# Altium schematic sheet Digital Isolator.SchDoc
size A3; Date: 27.05.2014; DrawnBy: luths8; Organization: BFH; Address1: Bern University of Applied Sciences; Address2: Engineering and Information Technology; Address3: Jlcoweg 1; Address4: CH-3400 Burgdorf; DocumentNumber: 17; Revision: 1.0; SheetNumber: 4; SheetTotal: 19; CurrentDate: 27.05.2014
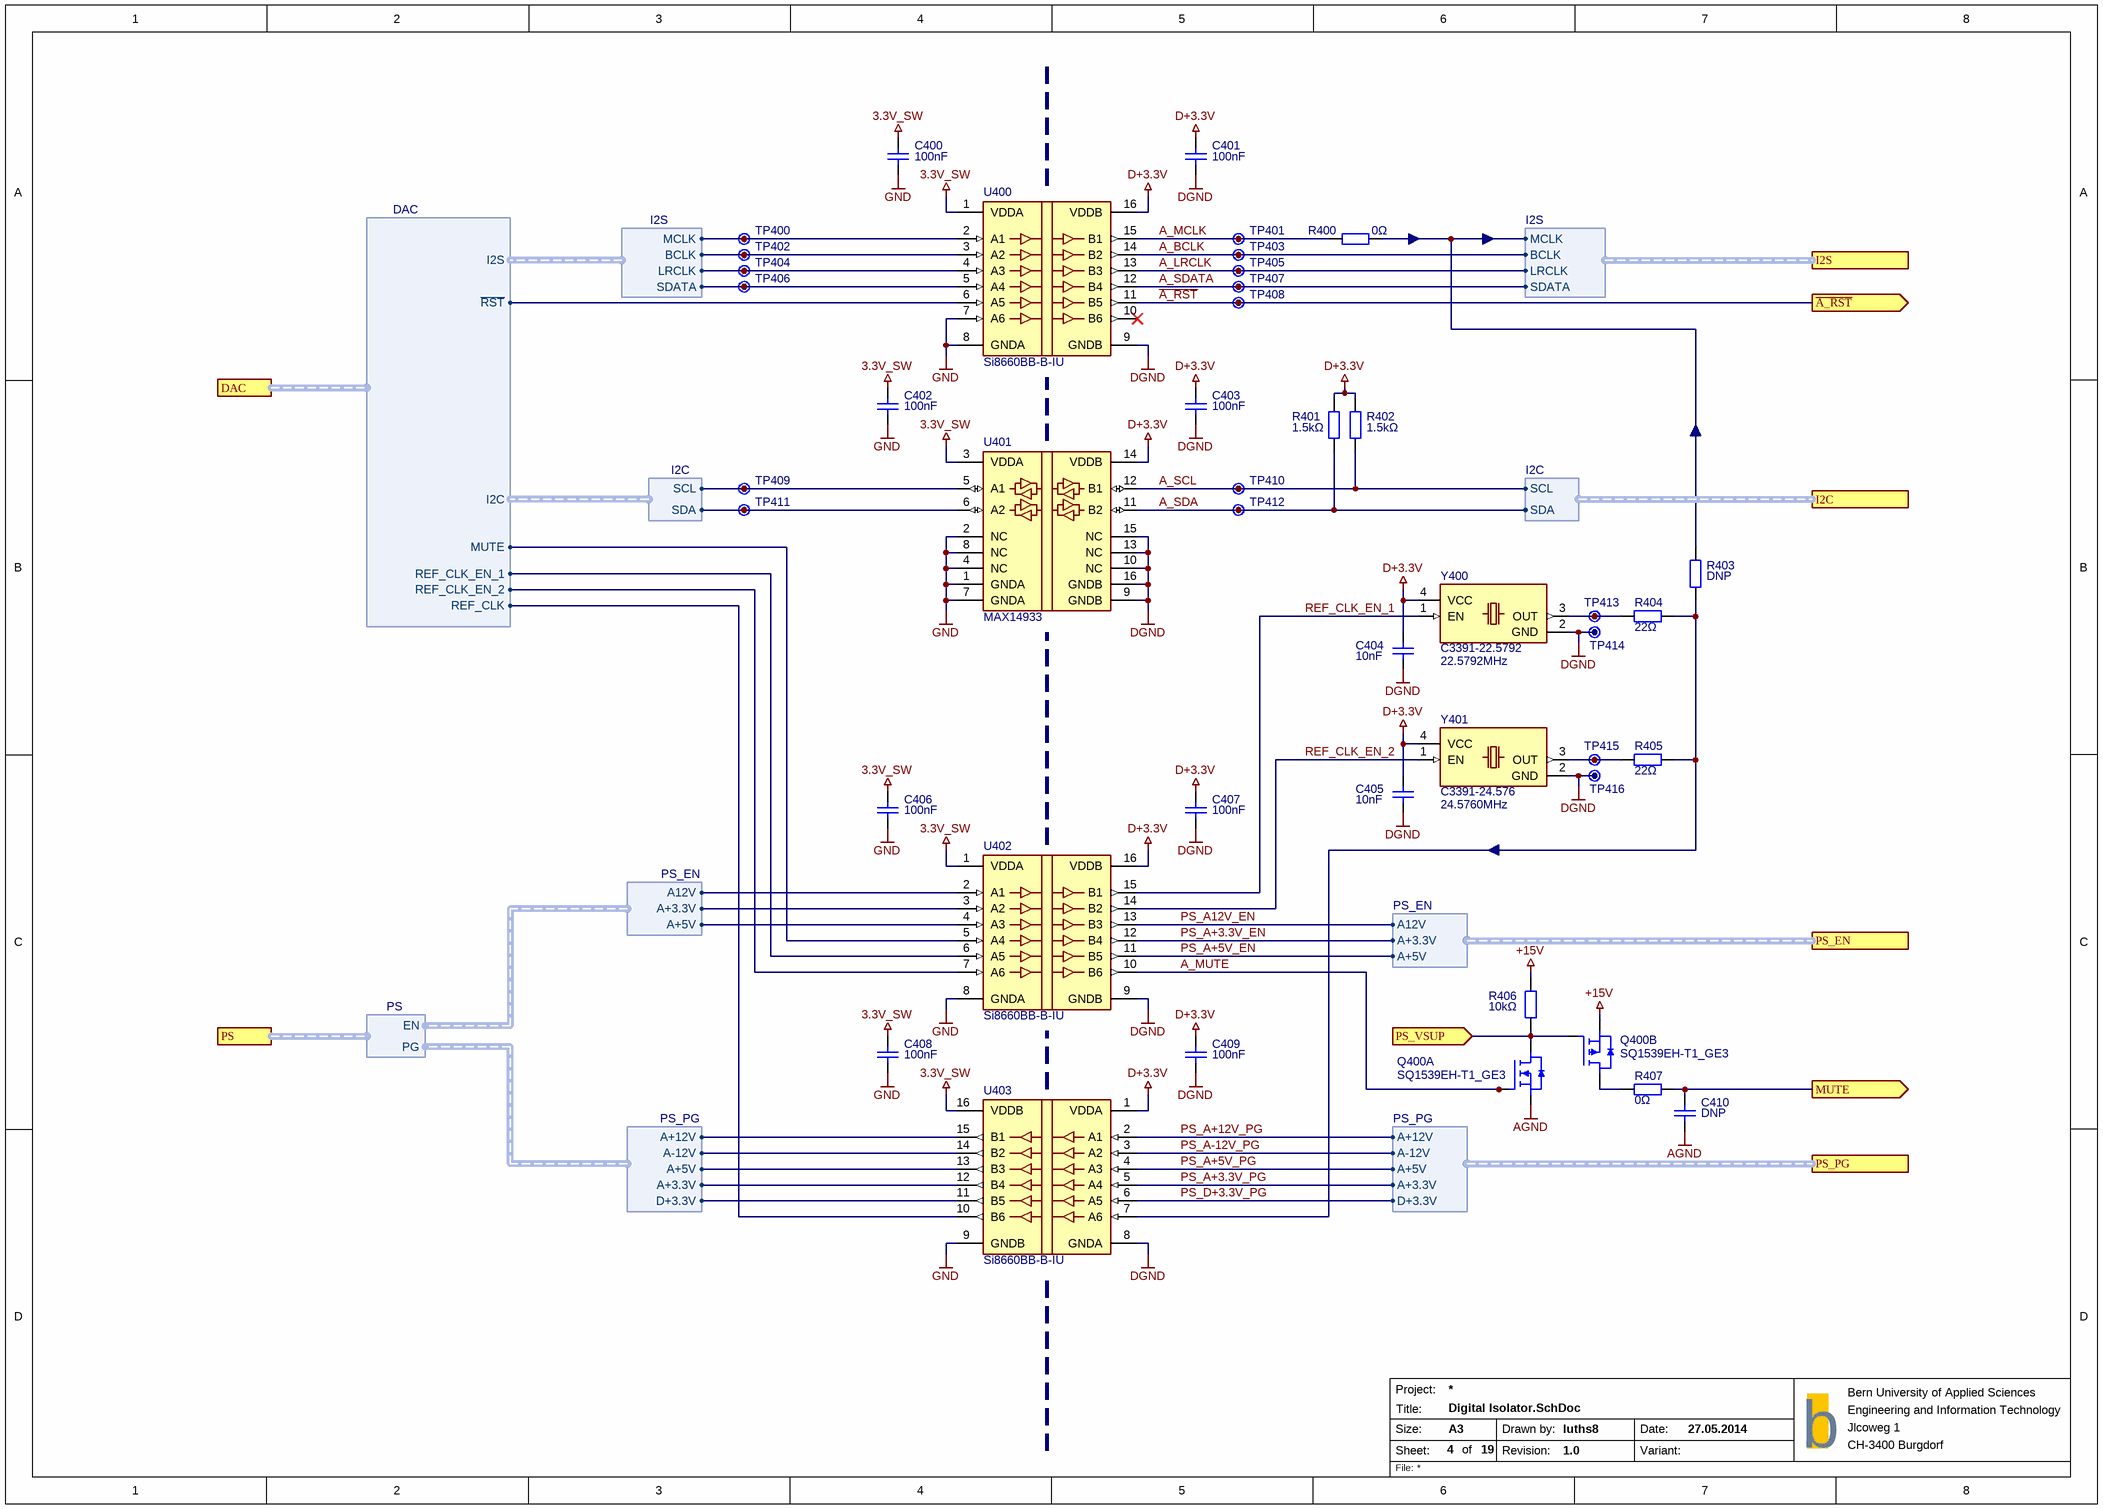
[diagram p0: Digital Isolator.SchDoc]

## Parts
C400  100nF  [SMD0603CAP]
C401  100nF  [SMD0603CAP]
C402  100nF  [SMD0603CAP]
C403  100nF  [SMD0603CAP]
C404  10nF  [SMD0603CAP]
C405  10nF  [SMD0603CAP]
C406  100nF  [SMD0603CAP]
C407  100nF  [SMD0603CAP]
C408  100nF  [SMD0603CAP]
C409  100nF  [SMD0603CAP]
C410  DNP  [SMD0603CAP]
Q400  SQ1539EH-T1_GE3  [SOT-363-6]  (parts A,B of 2)
R400  0Ω  [SMD0603RES]
R401  1.5kΩ  [SMD0603RES]
R402  1.5kΩ  [SMD0603RES]
R403  DNP  [SMD0603RES]
R404  22Ω  [SMD0603RES]
R405  22Ω  [SMD0603RES]
R406  10kΩ  [SMD0603RES]
R407  0Ω  [SMD0603RES]
TP400  Testpoint  [TP]  (value not drawn)  (no BOM)
TP401  Testpoint  [TP]  (value not drawn)  (no BOM)
TP402  Testpoint  [TP]  (value not drawn)  (no BOM)
TP403  Testpoint  [TP]  (value not drawn)  (no BOM)
TP404  Testpoint  [TP]  (value not drawn)  (no BOM)
TP405  Testpoint  [TP]  (value not drawn)  (no BOM)
TP406  Testpoint  [TP]  (value not drawn)  (no BOM)
TP407  Testpoint  [TP]  (value not drawn)  (no BOM)
TP408  Testpoint  [TP]  (value not drawn)  (no BOM)
TP409  Testpoint  [TP]  (value not drawn)  (no BOM)
TP410  Testpoint  [TP]  (value not drawn)  (no BOM)
TP411  Testpoint  [TP]  (value not drawn)  (no BOM)
TP412  Testpoint  [TP]  (value not drawn)  (no BOM)
TP413  Testpoint  [TP]  (value not drawn)  (no BOM)
TP414  Testpoint  [TP]  (value not drawn)  (no BOM)
TP415  Testpoint  [TP]  (value not drawn)  (no BOM)
TP416  Testpoint  [TP]  (value not drawn)  (no BOM)
U400  Si8660BB-B-IU  [SOIC16WIDE]
U401  MAX14933  [SOIC16WIDE]
U402  Si8660BB-B-IU  [SOIC16WIDE]
U403  Si8660BB-B-IU  [SOIC16WIDE]
Y400  C3391-22.5792  Frequency: 22.5792MHz  [OSC_CRYSTEK]
Y401  C3391-24.576  Frequency: 24.5760MHz  [OSC_CRYSTEK]

## Ports
DAC (harness DAC), I2C (harness I2C), I2S (harness I2S), MUTE (out), PS (harness PS), PS_EN (harness PS_EN), PS_PG (harness PS_PG), PS_VSUP (in), ~{A_RST} (out)

## Harnesses
I2S: MCLK, BCLK, LRCLK, SDATA
I2C: SCL, SDA
DAC: I2S, ~{RST}, I2C, MUTE, REF_CLK_EN_1, REF_CLK_EN_2, REF_CLK
PS_EN: A12V, A+3.3V, A+5V
PS_PG: A+12V, A-12V, A+3.3V, A+5V, D+3.3V
PS: EN, PG

## Nets
3.3V_SW: C400.1 C402.1 C406.1 C408.1 U400.1(VDDA) U401.3(VDDA) U402.1(VDDA) U403.16(VDDB)
+15V: Q400.4(S) R406.2
AGND: C410.2(q) Q400.1(S)
D+3.3V: C401.1 C403.1 C404.1 C405.1 C407.1 C409.1 R401.2 R402.2 U400.16(VDDB) U401.14(VDDB) U402.16(VDDB) U403.1(VDDA) Y400.4(VCC) Y401.4(VCC)
DGND: C401.2(q) C403.2(q) C404.2(q) C405.2(q) C407.2(q) C409.2(q) TP414.1 TP416.1 U400.9(GNDB) U401.9(GNDB) U401.10(NC) U401.13(NC) U401.15(NC) U401.16(GNDB) U402.9(GNDB) U403.8(GNDA) Y400.2(GND) Y401.2(GND)
GND: C400.2(q) C402.2(q) C406.2(q) C408.2(q) U400.7(A6) U400.8(GNDA) U401.1(GNDA) U401.2(NC) U401.4(NC) U401.7(GNDA) U401.8(NC) U402.8(GNDA) U403.9(GNDB)
~{A_RST}: TP408.1 U400.11(B5) ; port ~{A_RST}
A_BCLK: TP403.1 U400.14(B2) ; port I2S.BCLK
A_LRCLK: TP405.1 U400.13(B3) ; port I2S.LRCLK
A_MCLK: R400.2 TP401.1 U400.15(B1)
A_MUTE: Q400.2(G) U402.10(B6)
A_SCL: R402.1 TP410.1 U401.12(B1) ; port I2C.SCL
A_SDA: R401.1 TP412.1 U401.11(B2) ; port I2C.SDA
A_SDATA: TP407.1 U400.12(B4) ; port I2S.SDATA
MUTE: C410.1 R407.1 ; port MUTE
PS_A12V_EN: U402.13(B3) ; port PS_EN.A12V
PS_A+3.3V_EN: U402.12(B4) ; port PS_EN.A+3.3V
PS_A+3.3V_PG: U403.5(A4) ; port PS_PG.A+3.3V
PS_A+5V_EN: U402.11(B5) ; port PS_EN.A+5V
PS_A+5V_PG: U403.4(A3) ; port PS_PG.A+5V
PS_A+12V_PG: U403.2(A1) ; port PS_PG.A+12V
PS_A-12V_PG: U403.3(A2) ; port PS_PG.A-12V
PS_D+3.3V_PG: U403.6(A5) ; port PS_PG.D+3.3V
PS_VSUP: Q400.5(G) Q400.6(D) R406.1 ; port PS_VSUP
REF_CLK_EN_1: U402.15(B1) Y400.1(EN)
REF_CLK_EN_2: U402.14(B2) Y401.1(EN)
NetQ400_3: Q400.3(D) R407.2
NetR400_1: R400.1 R403.1 ; port I2S.MCLK
NetR403_2: R403.2 R404.2 R405.2 U403.7(A6)
NetR404_1: R404.1 TP413.1 Y400.3(OUT)
NetR405_1: R405.1 TP415.1 Y401.3(OUT)
NetTP400_1: TP400.1 U400.2(A1) ; harness I2S.MCLK
NetTP402_1: TP402.1 U400.3(A2) ; harness I2S.BCLK
NetTP404_1: TP404.1 U400.4(A3) ; harness I2S.LRCLK
NetTP406_1: TP406.1 U400.5(A4) ; harness I2S.SDATA
NetTP409_1: TP409.1 U401.5(A1) ; harness I2C.SCL
NetTP411_1: TP411.1 U401.6(A2) ; harness I2C.SDA
NetU400_6: U400.6(A5) ; port DAC.~{RST}
NetU402_2: U402.2(A1) ; harness PS_EN.A12V
NetU402_3: U402.3(A2) ; harness PS_EN.A+3.3V
NetU402_4: U402.4(A3) ; harness PS_EN.A+5V
NetU402_5: U402.5(A4) ; port DAC.MUTE
NetU402_6: U402.6(A5) ; port DAC.REF_CLK_EN_1
NetU402_7: U402.7(A6) ; port DAC.REF_CLK_EN_2
NetU403_10: U403.10(B6) ; port DAC.REF_CLK
NetU403_11: U403.11(B5) ; harness PS_PG.D+3.3V
NetU403_12: U403.12(B4) ; harness PS_PG.A+3.3V
NetU403_13: U403.13(B3) ; harness PS_PG.A+5V
NetU403_14: U403.14(B2) ; harness PS_PG.A-12V
NetU403_15: U403.15(B1) ; harness PS_PG.A+12V

Not connected (* = marked no-connect by the designer): U400 10(B6)*

## Notes on the sheet
- Project:
- Size:
- Sheet:
- Title:
- A3
- of
- Drawn by:
- Revision:
- Date:
- Variant:
- b
- File:

## Library data of the parts
C400-C410 = Capacitor Ceramic: Ceramic Capacitor; Voltage: *; Manufacturer Part No.: *
Q400 = Transistor N/PMOS Dual: Transistor Dual, NMOS & PMOS; Manufacturer Part No.: SQ1539EH-T1_GE3
R400-R407 = Resistor: Manufacturer Part No.: *
U400 U402 U403 = Si8660BB-B-IU: Unidirectional digital isolator; Manufacturer Part No.: Si8660BB-B-IU
U401 = MAX14933: Bidirectional digital isolator; Manufacturer Part No.: MAX14933
Y400 Y401 = Oscillator Crystek: HCMOS Oscillator
  Y400: Manufacturer Part No.: C3391-22.5792
  Y401: Manufacturer Part No.: C3391-24.576
TP400-TP416 = Testpoint: Manufacturer Part No.: *